# Altium schematic sheet 03_Power_IO.SchDoc
size A4; sheet_title: Power & IO; DocumentNumber: 3; SheetNumber: 3; SheetTotal: 4
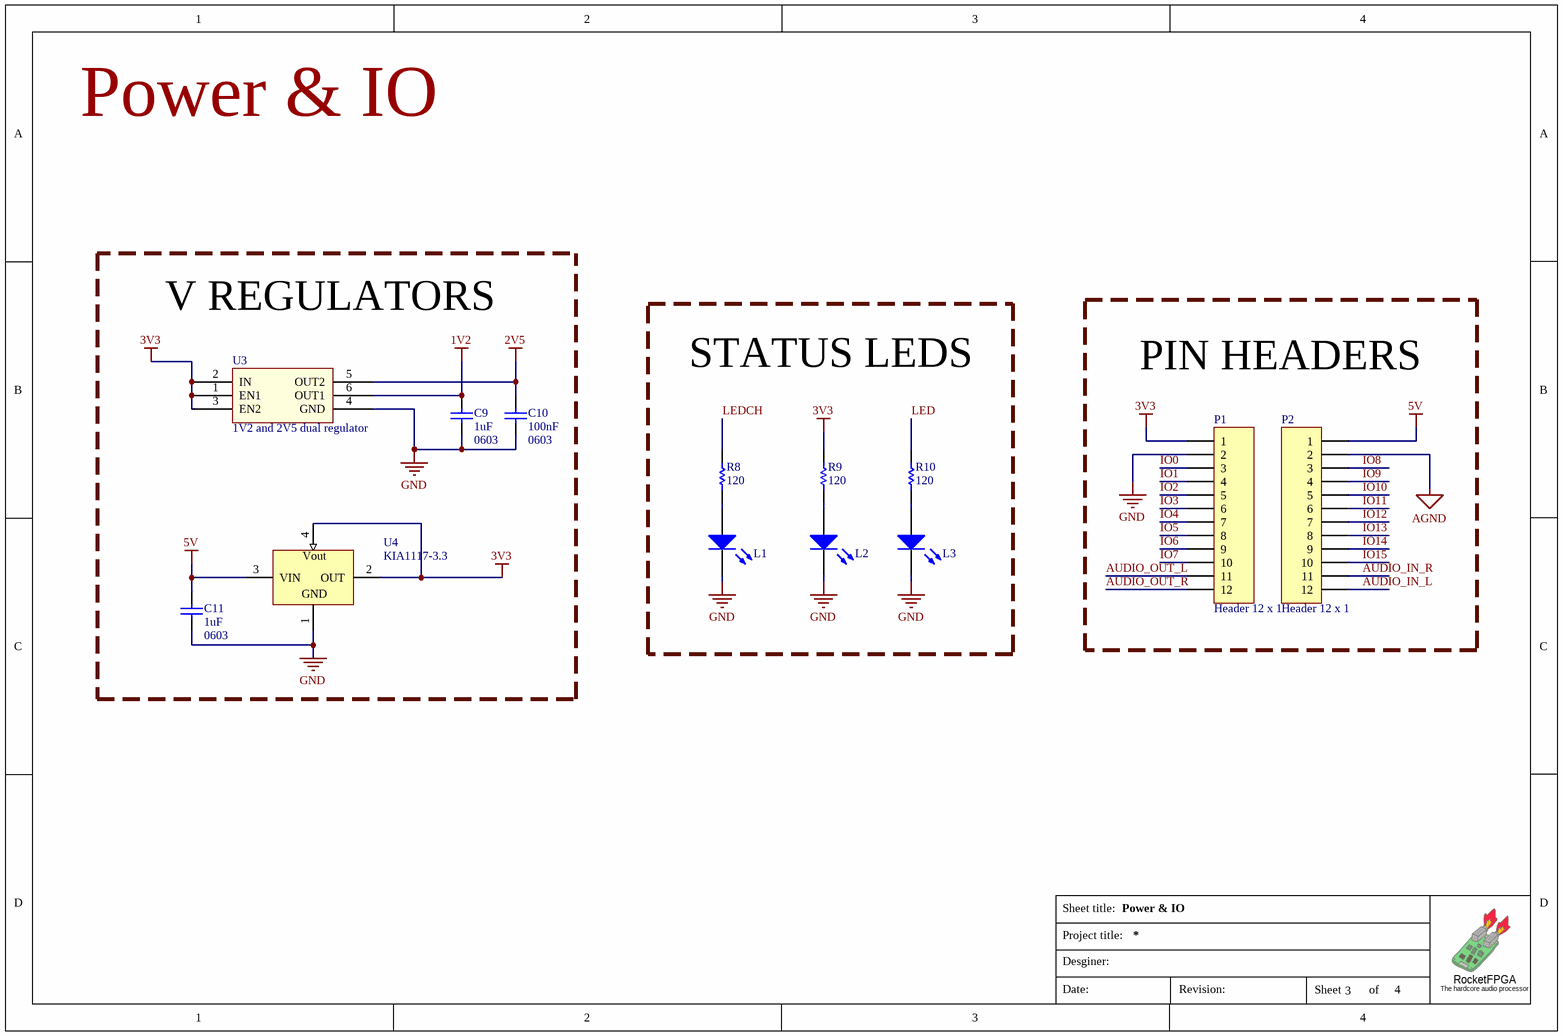
[diagram p0: 03_Power_IO.SchDoc]

## Parts
C9  value 1uF  Package: 0603  [0603 CAP]  (hidden comment: Ceramic capacitor)
C10  value 100nF  Package: 0603  [0603 CAP]  (hidden comment: Ceramic capacitor)
C11  value 1uF  Package: 0603  [0603 CAP]  (hidden comment: Ceramic capacitor)
L1  LED_SMD  [0805]  (value not drawn)
L2  LED_SMD  [0805]  (value not drawn)
L3  LED_SMD  [0805]  (value not drawn)
P1  Header 12 x 1  [HDR1X12]
P2  Header 12 x 1  [HDR1X12]
R8  value 120  [Resistencia 0603]  (hidden comment: Resistor)
R9  value 120  [Resistencia 0603]  (hidden comment: Resistor)
R10  value 120  [Resistencia 0603]  (hidden comment: Resistor)
U3  1V2 and 2V5 dual regulator  [DSE 6]
U4  KIA1117-3.3  [SOT-223]

## Blocks framed on the sheet
PIN HEADERS: P1 P2
STATUS LEDS: L1-L3 R8-R10

## Nets
1V2: C9.1 U3.6(OUT1)
2V5: C10.1 U3.5(OUT2)
3V3: P1.1 R9.2 U3.1(EN1) U3.2(IN) U3.3(EN2) U4.2(OUT) U4.4(Vout)
5V: C11.1 P2.1 U4.3(VIN)
AGND: P2.2
GND: C9.2 C10.2 C11.2 L1.2(K) L2.2(K) L3.2(K) P1.2 U3.4(GND) U4.1(GND)
AUDIO_IN_L: P2.12
AUDIO_IN_R: P2.11
AUDIO_OUT_L: P1.11
AUDIO_OUT_R: P1.12
IO0: P1.3
IO1: P1.4
IO2: P1.5
IO3: P1.6
IO4: P1.7
IO5: P1.8
IO6: P1.9
IO7: P1.10
IO8: P2.3
IO9: P2.4
IO10: P2.5
IO11: P2.6
IO12: P2.7
IO13: P2.8
IO14: P2.9
IO15: P2.10
LED: R10.2
LEDCH: R8.2
NetL1_1: L1.1(A) R8.1
NetL2_1: L2.1(A) R9.1
NetL3_1: L3.1(A) R10.1

## Notes on the sheet
- Power & IO
- V REGULATORS
- Sheet title:
- Project title:
- Desginer:
- The hardcore audio processor
- RocketFPGA
- Date:
- Revision:
- Sheet
- of

## Library data of the parts
C9 C11 = Capacitor: vendor: LCSC; vendorID: CC0603ZRY5V7BB105; Supplier 1: Mouser; Supplier Part Number 1: 80-C1206C104K5R; ManufacturerReference: -; price: 0.0053
C10 = Capacitor: vendor: LCSC; vendorID: 0603F104M500NT; Supplier 1: Mouser; Supplier Part Number 1: 80-C1206C104K5R; ManufacturerReference: -; price: 0.0023
L1-L3 = LED_SMD: LED SMD; vendor: Mouser; vendorID: 743-IN-S85AT5B; Supplier 1: Mouser; Supplier Part Number 1: 630-HSMC-C170; price: 0.087
P1 P2 = Header 12_1: Header, 11-Pin; Vendor: LCSC; Link: https://lcsc.com/product-detail/Pin-Header-Female-Header_CJT-Changjiang-Connectors-A2541WV-12P_C225487.html
R8-R10 = Resistor: vendor2: vendor; vendor: LCSC; vendorID: CR0603FA1200G; Supplier 1: Farnell; Supplier Part Number 1: 2358436; price: 0.0024
U3 = TLV7111225DSER: Vendor: LCSC; Link: https://lcsc.com/product-detail/Low-Dropout-Regulators-LDO_Texas-Instruments-TLV7111225DSER_C201579.html
U4 = KIA1117-3.3: 5V to 3.3V 800mA Low-Dropout Linear Regulator; Vendor: LCSC; Link: https://lcsc.com/product-detail/Low-Dropout-Regulators-LDO_PUOLOP-AMS1117-3-3_C351784.html